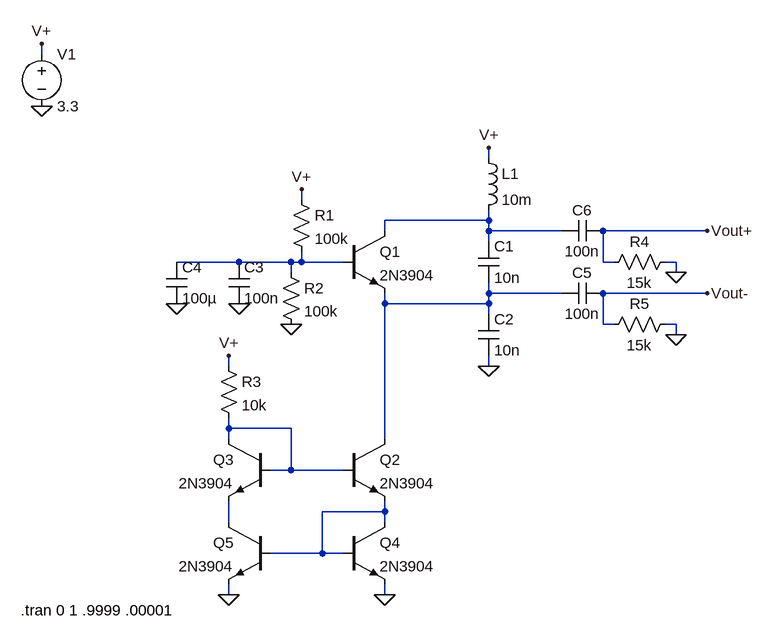
[diagram p0: schematic 06A-15.asc]
06A-15.asc, the LTspice schematic file:
Version 4.1
SHEET 1 968 756
WIRE -144 -128 -144 -144
WIRE 544 32 544 16
WIRE 256 96 256 80
WIRE 544 128 544 112
WIRE 544 128 384 128
WIRE 384 144 384 128
WIRE 544 144 544 128
WIRE 656 144 544 144
WIRE 880 144 720 144
WIRE 544 160 544 144
WIRE 160 192 64 192
WIRE 240 192 160 192
WIRE 256 192 256 176
WIRE 256 192 240 192
WIRE 320 192 256 192
WIRE 720 192 720 144
WIRE 736 192 720 192
WIRE 832 192 816 192
WIRE 240 208 240 192
WIRE 832 208 832 192
WIRE 544 240 544 224
WIRE 656 240 544 240
WIRE 880 240 720 240
WIRE 384 256 384 240
WIRE 544 256 544 240
WIRE 544 256 384 256
WIRE 544 272 544 256
WIRE 720 288 720 240
WIRE 736 288 720 288
WIRE 832 288 816 288
WIRE 832 304 832 288
WIRE 144 352 144 336
WIRE 544 352 544 336
WIRE 144 448 144 432
WIRE 240 448 144 448
WIRE 144 464 144 448
WIRE 384 464 384 256
WIRE 240 512 240 448
WIRE 240 512 208 512
WIRE 320 512 240 512
WIRE 384 576 384 560
WIRE 384 576 288 576
WIRE 144 592 144 560
WIRE 384 592 384 576
WIRE 288 640 288 576
WIRE 288 640 208 640
WIRE 320 640 288 640
WIRE 144 704 144 688
WIRE 384 704 384 688
FLAG -144 -48 0
FLAG -144 -144 V+
FLAG 544 352 0
FLAG 240 288 0
FLAG 144 704 0
FLAG 384 704 0
FLAG 144 336 V+
FLAG 256 80 V+
FLAG 544 16 V+
FLAG 880 144 Vout+
FLAG 880 240 Vout-
FLAG 160 256 0
FLAG 64 256 0
FLAG 832 208 0
FLAG 832 304 0
SYMBOL voltage -144 -144 R0
WINDOW 123 0 0 Left 0
WINDOW 39 0 0 Left 0
SYMATTR InstName V1
SYMATTR Value 3.3
SYMBOL ind 528 16 R0
SYMATTR InstName L1
SYMATTR Value 10m
SYMBOL cap 528 160 R0
SYMATTR InstName C1
SYMATTR Value 10n
SYMBOL cap 528 272 R0
SYMATTR InstName C2
SYMATTR Value 10n
SYMBOL npn 320 144 R0
SYMATTR InstName Q1
SYMATTR Value 2N3904
SYMBOL res 240 80 R0
SYMATTR InstName R1
SYMATTR Value 100k
SYMBOL res 224 192 R0
SYMATTR InstName R2
SYMATTR Value 100k
SYMBOL npn 320 464 R0
SYMATTR InstName Q2
SYMATTR Value 2N3904
SYMBOL npn 208 464 M0
SYMATTR InstName Q3
SYMATTR Value 2N3904
SYMBOL npn 320 592 R0
SYMATTR InstName Q4
SYMATTR Value 2N3904
SYMBOL npn 208 592 M0
SYMATTR InstName Q5
SYMATTR Value 2N3904
SYMBOL res 128 336 R0
SYMATTR InstName R3
SYMATTR Value 10k
SYMBOL cap 144 192 R0
SYMATTR InstName C3
SYMATTR Value 100n
SYMBOL cap 48 192 R0
SYMATTR InstName C4
SYMATTR Value 100µ
SYMBOL cap 720 224 R90
WINDOW 0 0 32 VBottom 2
WINDOW 3 32 32 VTop 2
SYMATTR InstName C5
SYMATTR Value 100n
SYMBOL cap 720 128 R90
WINDOW 0 0 32 VBottom 2
WINDOW 3 32 32 VTop 2
SYMATTR InstName C6
SYMATTR Value 100n
SYMBOL res 720 208 R270
WINDOW 0 32 56 VTop 2
WINDOW 3 0 56 VBottom 2
SYMATTR InstName R4
SYMATTR Value 15k
SYMBOL res 720 304 R270
WINDOW 0 32 56 VTop 2
WINDOW 3 0 56 VBottom 2
SYMATTR InstName R5
SYMATTR Value 15k
TEXT -176 728 Left 2 !.tran 0 1 .9999 .00001

The netlist it stands for:
* 06A-15.asc
V1 V+ 0 3.3
L1 V+ N001 10m
C1 N001 N003 10n
C2 N003 0 10n
Q1 N001 N002 N003 0 2N3904
R1 V+ N002 100k
R2 N002 0 100k
Q2 N003 N004 N005 0 2N3904
Q3 N004 N004 N006 0 2N3904
Q4 N005 N005 0 0 2N3904
Q5 N006 N005 0 0 2N3904
R3 V+ N004 10k
C3 N002 0 100n
C4 N002 0 100µ
C5 Vout- N003 100n
C6 Vout+ N001 100n
R4 Vout+ 0 15k
R5 Vout- 0 15k
.model NPN NPN
.model PNP PNP
.lib standard.bjt
.tran 0 1 .9999 .00001
.backanno
.end